# Altium schematic sheet LAPPA-2020.SchDoc
size A1
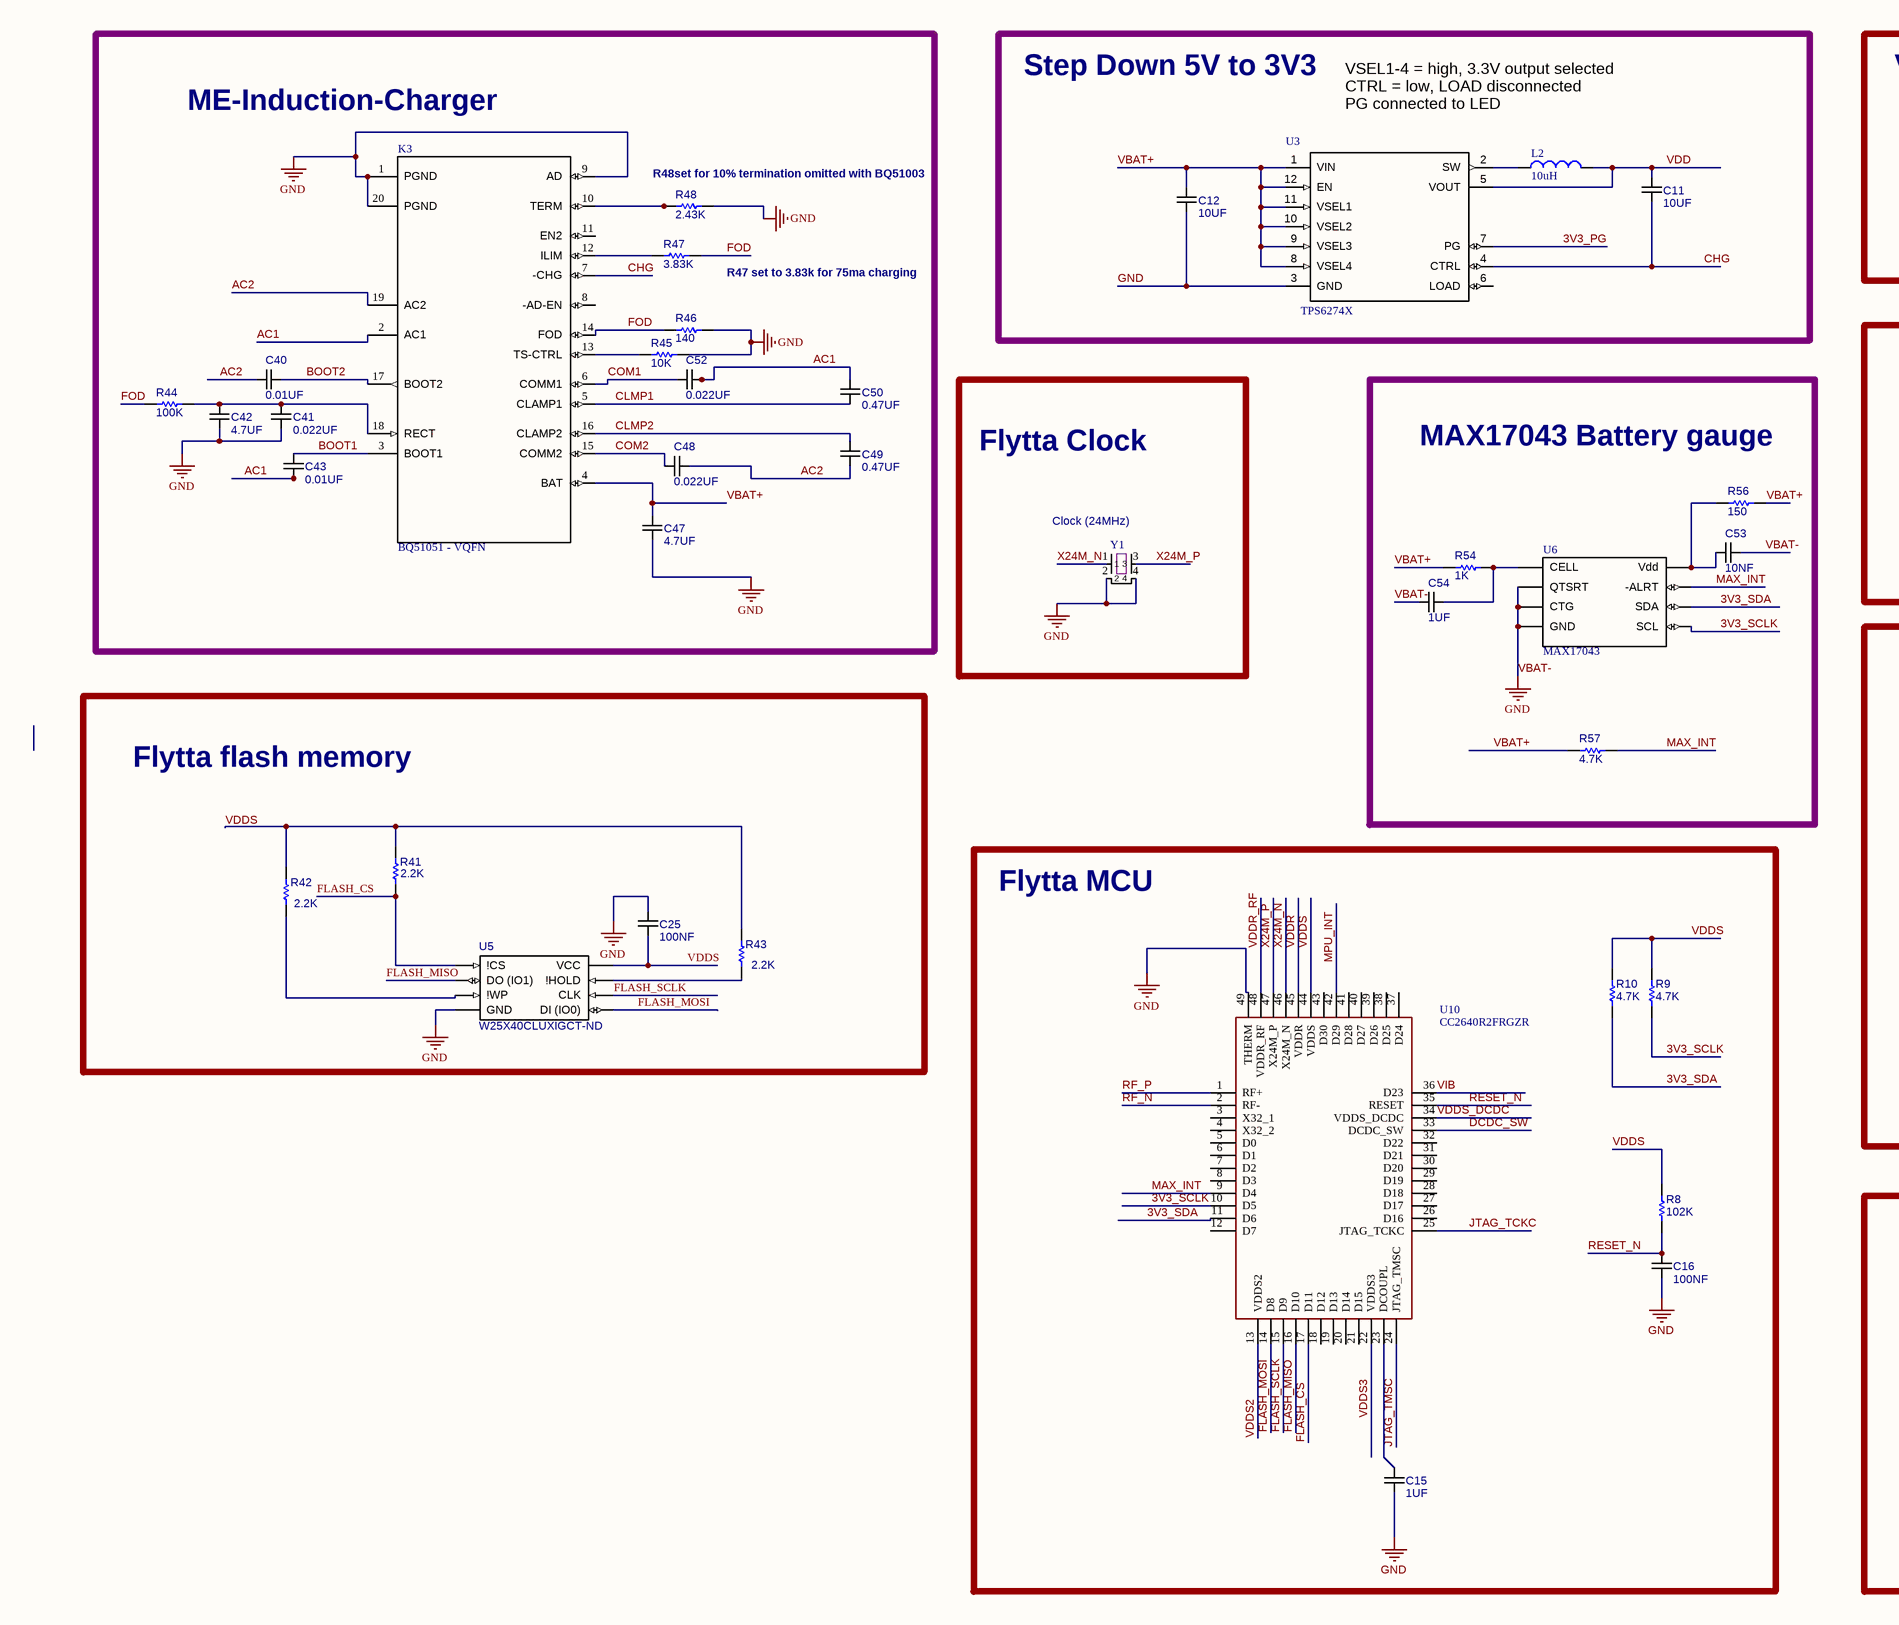
[diagram p0: LAPPA-2020.SchDoc, left]
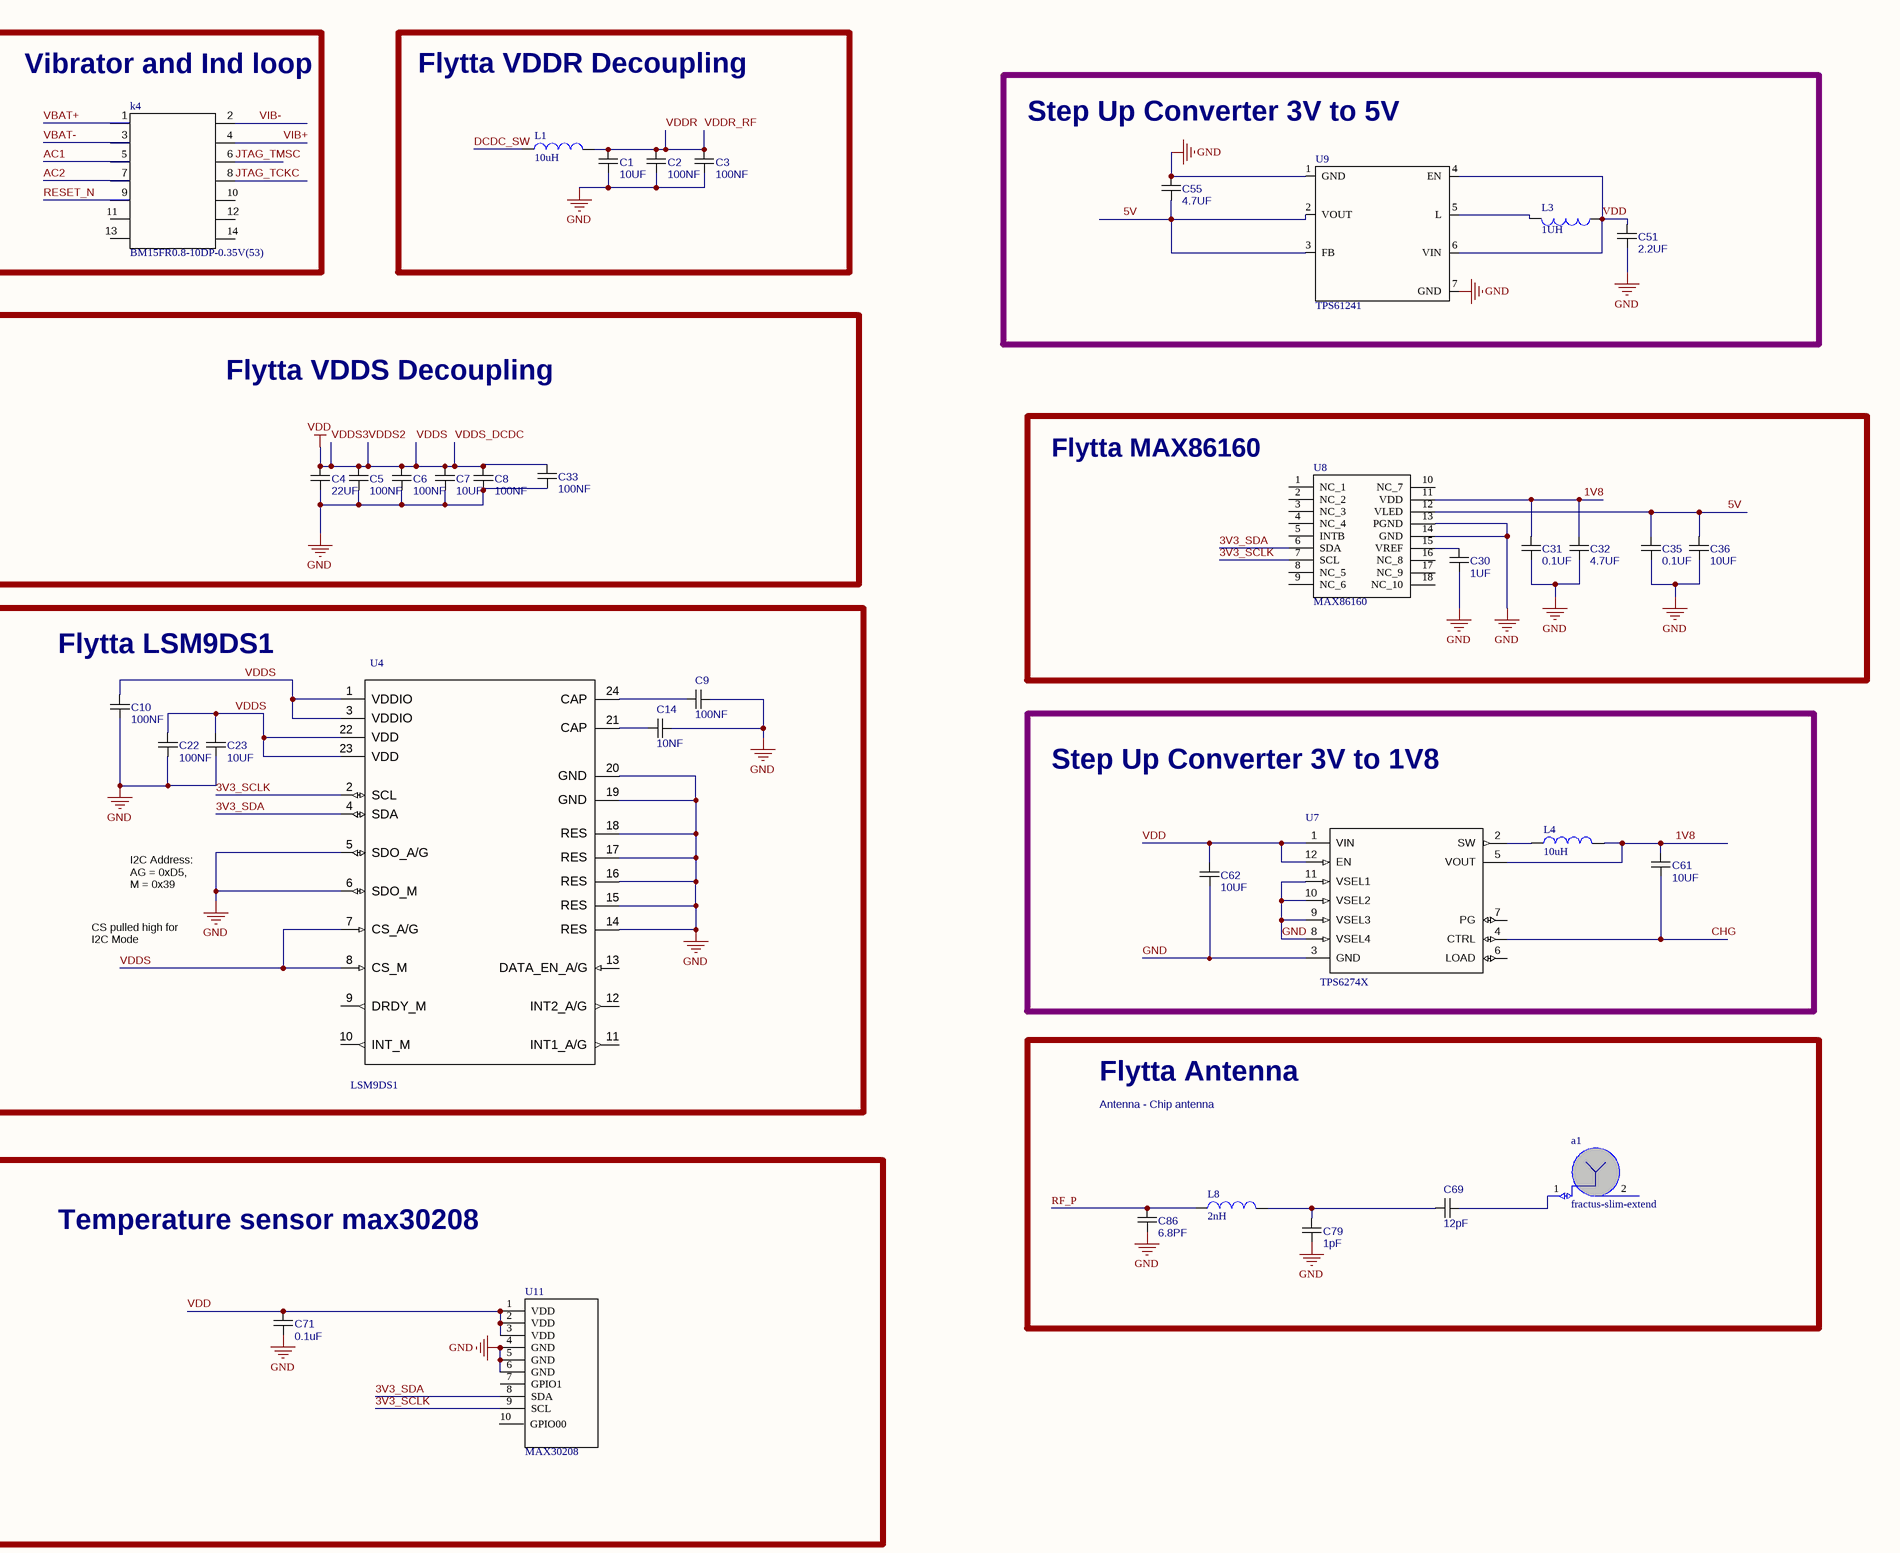
[diagram p1: LAPPA-2020.SchDoc, right]

## Parts
a1  fractus-slim-extend  [fractus-chip-antenna]
C1  10UF  [Passive (0402, 1005)]
C2  100NF  [Passive (0402, 1005)]
C3  100NF  [Passive (0402, 1005)]
C4  22UF  [Passive (0402, 1005)]
C5  100NF  [Passive (0402, 1005)]
C6  100NF  [Passive (0402, 1005)]
C7  10UF  [Passive (0402, 1005)]
C8  100NF  [Passive (0402, 1005)]
C9  100NF  [Passive (0402, 1005)]
C10  100NF  [Passive (0402, 1005)]
C11  10UF  [Passive (0402, 1005)]
C12  10UF  [Passive (0402, 1005)]
C14  10NF  [Passive (0402, 1005)]
C15  1UF  [Passive (0402, 1005)]
C16  100NF  [Passive (0402, 1005)]
C22  100NF  [Passive (0402, 1005)]
C23  10UF  [Passive (0402, 1005)]
C25  100NF  [Passive (0402, 1005)]
C30  1UF  [Passive (0402, 1005)]
C31  0.1UF  [Passive (0402, 1005)]
C32  4.7UF  [Passive (0402, 1005)]
C33  100NF  [Passive (0402, 1005)]
C35  0.1UF  [Passive (0402, 1005)]
C36  10UF  [Passive (0402, 1005)]
C40  0.01UF  [Passive (0402, 1005)]
C41  0.022UF  [Passive (0402, 1005)]
C42  4.7UF  [Passive (0402, 1005)]
C43  0.01UF  [Passive (0402, 1005)]
C47  4.7UF  [Passive (0402, 1005)]
C48  0.022UF  [Passive (0402, 1005)]
C49  0.47UF  [Passive (0402, 1005)]
C50  0.47UF  [Passive (0402, 1005)]
C51  2.2UF  [Passive (0402, 1005)]
C52  0.022UF  [Passive (0402, 1005)]
C53  10NF  [Passive (0402, 1005)]
C54  1UF  [Passive (0402, 1005)]
C55  4.7UF  [Passive (0402, 1005)]
C61  10UF  [Passive (0402, 1005)]
C62  10UF  [Passive (0402, 1005)]
C69  12pF  [Passive (0402, 1005)]
C71  0.1uF  [Passive (0402, 1005)]
C79  1pF  [Passive (0402, 1005)]
C86  6.8PF  [Passive (0402, 1005)]
K3  BQ51051 - VQFN  [bq51051 - vqfn]
k4  BM15FR0.8-10DP-0.35V(53)  [BM15-Header]
L1  10uH  [Passive (0603, 1608)]
L2  10uH  [Passive (0603, 1608)]
L3  1UH  [Passive (0603, 1608)]
L4  10uH  [Passive (0603, 1608)]
L8  2nH  [Passive (0402, 1005)]
R8  102K  [Passive (0402, 1005)]
R9  4.7K  [Passive (0402, 1005)]
R10  4.7K  [Passive (0402, 1005)]
R41  2.2K  [Passive (0402, 1005)]
R42  2.2K  [Passive (0402, 1005)]
R43  2.2K  [Passive (0402, 1005)]
R44  100K  [Passive (0402, 1005)]
R45  10K  [Passive (0402, 1005)]
R46  140  [Passive (0402, 1005)]
R47  3.83K  [Passive (0402, 1005)]
R48  2.43K  [Passive (0402, 1005)]
R54  1K  [Passive (0402, 1005)]
R56  150  [Passive (0402, 1005)]
R57  4.7K  [Passive (0402, 1005)]
U3  TPS6274X  [TPS6274]
U4  LSM9DS1  [LSM9DS1]
U5  W25X40CLUXIGCT-ND  [USON 2x3]
U6  MAX17043  [MAX17043]
U7  TPS6274X  [TPS6274]
U8  MAX86160  [MAX86160]
U9  TPS61241  [TPS61241]
U10  CC2640R2FRGZR  [CC2640R2FRGZR]
U11  MAX30208  [MAX30208]
Y1  24MHz crystal  [TSX-3225]  (value not drawn)

## Blocks framed on the sheet
ME-Induction-Charger: C40-C43 C47-C50 C52 K3 R44-R48
Step Down 5V to 3V3: C11 C12 L2 U3
Vibrator and Ind loop: k4
Flytta VDDR Decoupling: C1-C3 L1
Step Up Converter 3V to 5V: C51 C55 L3 U9
Flytta VDDS Decoupling: C4-C8 C33
Flytta Clock: Y1
MAX17043 Battery gauge: C53 C54 R54 R56 R57 U6
Flytta MAX86160: C30-C32 C35 C36 U8
Flytta LSM9DS1: C9 C10 C14 C22 C23 U4
Flytta flash memory: C25 R41-R43 U5
Step Up Converter 3V to 1V8: C61 C62 L4 U7
Flytta MCU: C15 C16 R8-R10 U10
Flytta Antenna: a1 C69 C79 C86 L8
Temperature sensor max30208: C71 U11

## Nets
GND: C1.1 C2.1 C3.1 C4.1 C5.1 C6.1 C7.1 C8.1 C9.1 C10.2 C12.1 C14.1 C15.1 C16.1 C22.1 C23.1 C25.2 C30.1 C31.1 C32.1 C33.1 C35.1 C36.1 C41.2 C42.2 C47.2 C51.1 C53.2 C54.1 C55.2 C62.1 C71.1 C79.1 C86.1 K3.1(PGND) K3.9(AD) K3.20(PGND) k4.3 R45.1 R46.1 R48.1 U3.3(GND) U4.5(SDO_A/G) U4.6(SDO_M) U4.14(RES) U4.15(RES) U4.16(RES) U4.17(RES) U4.18(RES) U4.19(GND) U4.20(GND) U5.4(GND) U6.A3(CTG) U6.B1(QTSRT) U6.C3(GND) U7.3(GND) U7.8(VSEL4) U7.9(VSEL3) U7.10(VSEL2) U7.11(VSEL1) U8.13(PGND) U8.14(GND) U9.1(GND) U9.7(GND) U10.49(THERM) U11.4(GND) U11.5(GND) U11.6(GND) Y1.2 Y1.4  [also labelled VBAT-]
VDD: C4.2 C5.2 C6.2 C7.2 C8.2 C10.1 C11.2 C22.2 C23.2 C25.1 C33.2 C51.2 C62.2 C71.2 L2.2 L3.1 R8.2 R9.2 R10.2 R41.2 R42.2 R43.2 U3.5(VOUT) U4.1(VDDIO) U4.3(VDDIO) U4.7(CS_A/G) U4.8(CS_M) U4.22(VDD) U4.23(VDD) U5.8(VCC) U7.1(VIN) U7.12(EN) U9.4(EN) U9.6(VIN) U10.13(VDDS2) U10.22(VDDS3) U10.34(VDDS_DCDC) U10.44(VDDS) U11.1(VDD) U11.2(VDD) U11.3(VDD)  [also labelled VDDS, VDDS2, VDDS3, VDDS_DCDC]
1V8: C31.2 C32.2 C61.2 L4.2 U7.5(VOUT) U8.11(VDD)
3V3_PG: U3.7(PG)
3V3_SCLK: R9.1 U4.2(SCL) U6.A2(SCL) U8.7(SCL) U10.10(D5) U11.9(SCL)
3V3_SDA: R10.1 U4.4(SDA) U6.A1(SDA) U8.6(SDA) U10.11(D6) U11.8(SDA)
5V: C35.2 C36.2 C55.1 U8.12(VLED) U9.2(VOUT) U9.3(FB)
AC1: C43.2 C50.1 C52.2 K3.2(AC1) k4.5
AC2: C40.2 C48.2 C49.2 K3.19(AC2) k4.7
BOOT1: C43.1 K3.3(BOOT1)
BOOT2: C40.1 K3.17(BOOT2)
CHG: C11.1 C61.1 K3.7(-CHG) U3.4(CTRL) U7.4(CTRL)
CLMP1: C50.2 K3.5(CLAMP1)
CLMP2: C49.1 K3.16(CLAMP2)
COM1: C52.1 K3.6(COMM1)
COM2: C48.1 K3.15(COMM2)
DCDC_SW: L1.1 U10.33(DCDC_SW)
FLASH_CS: R41.1 U5.1(!CS) U10.17(D11)
FLASH_MISO: U5.2(DO_(IO1)) U10.16(D10)
FLASH_MOSI: U5.5(DI_(IO0)) U10.14(D8)
FLASH_SCLK: U5.6(CLK) U10.15(D9)
FOD: K3.14(FOD) R44.2 R46.2 R47.1
JTAG_TCKC: k4.8 U10.25(JTAG_TCKC)
JTAG_TMSC: k4.6 U10.24(JTAG_TMSC)
MAX_INT: R57.1 U6.C1(-ALRT) U10.9(D4)
MPU_INT: U10.42(D29)
RESET_N: C16.2 k4.9 R8.1 U10.35(RESET)
RF_N: U10.2(RF-)
RF_P: C86.2 L8.1 U10.1(RF+)
VBAT+: C12.2 C47.1 K3.4(BAT) k4.1 R54.2 R56.1 R57.2 U3.1(VIN) U3.8(VSEL4) U3.9(VSEL3) U3.10(VSEL2) U3.11(VSEL1) U3.12(EN)
VDDR: C1.2 C2.2 C3.2 L1.2 U10.45(VDDR) U10.48(VDDR_RF)  [also labelled VDDR_RF]
VIB: U10.36(D23)
VIB+: k4.4
VIB-: k4.2
X24M_N: U10.46(X24M_N) Y1.1
X24M_P: U10.47(X24M_P) Y1.3
Neta1_1: a1.1(FEED1) C69.1
NetC9_2: C9.2 U4.24(CAP)
NetC14_2: C14.2 U4.21(CAP)
NetC15_2: C15.2 U10.23(DCOUPL)
NetC30_2: C30.2 U8.15(VREF)
NetC41_1: C41.1 C42.1 K3.18(RECT) R44.1
NetC53_1: C53.1 R56.2 U6.C2(Vdd)
NetC54_2: C54.2 R54.1 U6.B3(CELL)
NetC69_2: C69.2 C79.2 L8.2
NetK3_10: K3.10(TERM) R48.2
NetK3_12: K3.12(ILIM) R47.2
NetK3_13: K3.13(TS-CTRL) R45.2
NetL2_1: L2.1 U3.2(SW)
NetL3_2: L3.2 U9.5(L)
NetL4_1: L4.1 U7.2(SW)
NetR42_1: R42.1 U5.3(!WP)
NetR43_1: R43.1 U5.7(!HOLD)

Not connected (* = marked no-connect by the designer): a1 2(GND); K3 8(-AD-EN) 11(EN2); k4 10 11 12 13 14; U3 6(LOAD); U4 9(DRDY_M) 10(INT_M) 11(INT1_A/G) 12(INT2_A/G) 13(DATA_EN_A/G); U7 6(LOAD) 7(PG); U8 1(NC_1) 2(NC_2) 3(NC_3) 4(NC_4) 5(INTB) 8(NC_5) 9(NC_6) 10(NC_7) 16(NC_8) 17(NC_9) 18(NC_10); U10 3(X32_1) 4(X32_2) 5(D0) 6(D1) 7(D2) 8(D3) 12(D7) 18(D12) 19(D13) 20(D14) 21(D15) 26(D16) 27(D17) 28(D18) 29(D19) 30(D20) 31(D21) 32(D22) 37(D24) 38(D25) 39(D26) 40(D27) 41(D28) 43(D30); U11 7(GPIO1) 10(GPIO00)

## Notes on the sheet
- VSEL1-4 = high, 3.3V output selected
  CTRL = low, LOAD disconnected
  PG connected to LED
- (near R48) R48set for 10% termination omitted with BQ51003
- R47 set to 3.83k for 75ma charging
- (near Y1) Clock (24MHz)
- I2C Address: AG = 0xD5, M = 0x39
- CS pulled high for I2C Mode
- Antenna - Chip antenna

## Library data of the parts
a1 = fractus-chip-antenna: fractus ti chip antenna
C1-C12 C14-C16 C22 C23 C25 C30-C33 C35 C36 C40-C43 C47-C55 C61 C62 C69 C71 C79 C86 = Capacitor: Ceramic chip capacitor; Value: *
k4 = bm15
L1-L4 L8 = Inductor: Code_IEC: 1005; Value: 10mH; Published: 8-Jun-2000; LatestRevisionDate: 29-May-2009; LatestRevisionNote: IPC-7351 Footprint Added.; PackageReference: 0402-A; Publisher: Altium Limited; PackageDescription: Chip Inductor; Code_JEITA: 0402
R8-R10 R41-R48 R54 R56 R57 = Resistor: Value: *
U3 U7 = TPS6274X: Step down converter
U4 = LSM9DS1: 9DOF, Accel, Gyro, Mag; MF: Microchip; MP: MCP73871-3CAI/ML; Availability: Good; Package: QFN-20 Microchip; Price: 1.56 USD; Value: *
U6 = MAX17043: I2C battery gauge
Y1 = TSX-3225